# EAGLE design MCUBOARD-1-V.1.0 (EAGLE 5.06)
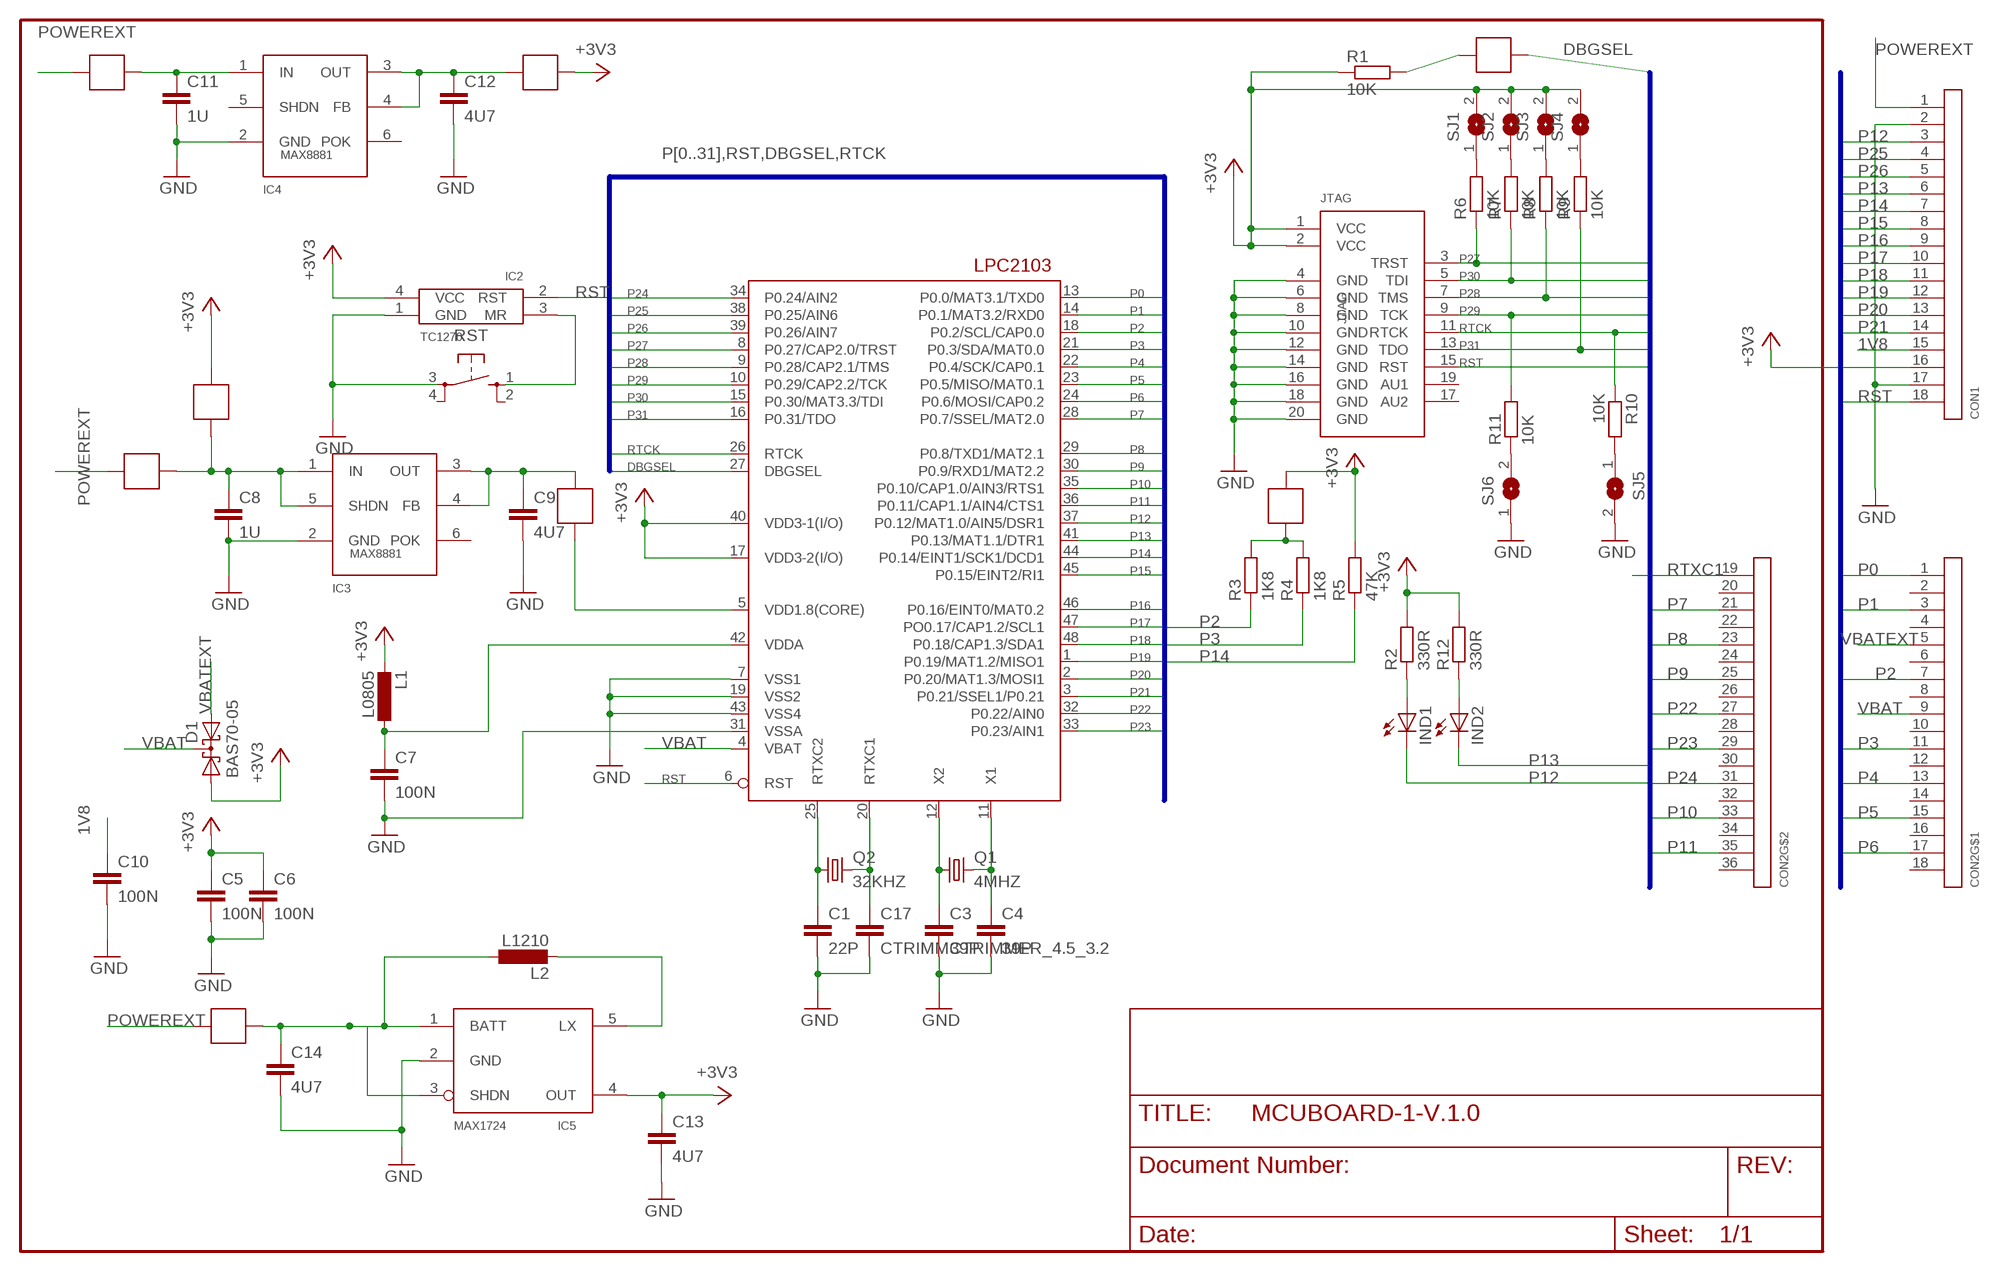
[diagram p0: schematic, sheet 1]

## Parts
C1  22P  C-EUC0805K  [C0805K]
C3  39P  C-EUC0603K  [C0603K]
C4  39P  C-EUC0603K  [C0603K]
C5  100N  C-EUC0805  [C0805]
C6  100N  C-EUC0805  [C0805]
C7  100N  C-EUC0603  [C0603]
C8  1U  C-EUC0805  [C0805]
C9  4U7  C-EUC0805  [C0805]
C10  100N  C-EUC0805  [C0805]
C11  1U  C-EUC0805  [C0805]
C12  4U7  C-EUC0805  [C0805]
C13  4U7  C-EUC0805  [C0805]
C14  4U7  C-EUC0805  [C0805]
C17  CTRIMMCTRIMMER_4.5_3.2  [CTRIMMER_4.5_3.2]
CON1  CON18ARMCON  [CON-ARMED-18-1]
CON2  CON18-2  [CON-ARMED-18-2]
D1  BAS70-05  [SOT23]
I2C  SOLDERJUMPER  [SOLDERJUMP1]
IC1  LPC2103  [LQFP48]
IC2  TC1270  [SOT143R_INFINEON]
IC3  MAX8881-18  MAX8881  [SOT23-6L]
IC4  MAX8881-33  MAX8881  [SOT23-6L]
IC5  MAX1724  [SOT23-5L]
IND1  LEDCHIPLED_0805  [CHIPLED_0805]
IND2  LEDCHIPLED_0805  [CHIPLED_0805]
JDBGSEL  SOLDERJUMPER  [SOLDERJUMP1]
JTAG  ARM-JTAGVERTIKAL  [ML20]
L1  L0805  [C0805]
L2  L1210  [C1210]
Q1  4MHZ  CRYTALHC49S  [HC49/S]
Q2  32KHZ  CRYTALTC26V  [TC26V]
R1  10K  R-EU_M0805  [M0805]
R2  330R  R-EU_M0805  [M0805]
R3  1K8  R-EU_M0805  [M0805]
R4  1K8  R-EU_M0805  [M0805]
R5  47K  R-EU_M0805  [M0805]
R6  10K  R-EU_M0805  [M0805]
R7  10K  R-EU_M0805  [M0805]
R8  10K  R-EU_M0805  [M0805]
R9  10K  R-EU_M0805  [M0805]
R10  10K  R-EU_M0805  [M0805]
R11  10K  R-EU_M0805  [M0805]
R12  330R  R-EU_M0805  [M0805]
REG3V3-1V8  SOLDERJUMPER  [SOLDERJUMP1]
RST  10XXSMD  [B3F-10XX-SMD]
SJ1  SJ  [SJ]
SJ2  SJ  [SJ]
SJ3  SJ  [SJ]
SJ4  SJ  [SJ]
SJ5  SJ  [SJ]
SJ6  SJ  [SJ]
U$1  SOLDERJUMPER  [SOLDERJUMP1]
U$2  SOLDERJUMPER  [SOLDERJUMP1]
U$3  SOLDERJUMPER  [SOLDERJUMP1]
U$4  SOLDERJUMPER  [SOLDERJUMP1]
U$6  SOLDERJUMPER  [SOLDERJUMP1]

## Nets
1V8: C10.1 CON1.15 IC1.5(VDD1.8(CORE)) U$4.2
+3V3: C5.1 C6.1 C13.1 CON1.16 D1.1(A1) I2C.1 IC1.17(VDD3-2(I/O)) IC1.40(VDD3-1(I/O)) IC2.4(VCC) IC5.4(OUT) JTAG.1(VCC) JTAG.2(VCC) L1.2 R1.1 R2.2 R5.2 R12.2 REG3V3-1V8.1 SJ1.2 SJ2.2 SJ3.2 SJ4.2 U$2.1
DBGSEL: IC1.27(DBGSEL) JDBGSEL.2
GND: C1.2 C3.2 C4.2 C5.2 C6.2 C7.2 C8.2 C9.2 C10.2 C11.2 C12.2 C13.2 C14.2 C17.P$2 CON1.2 CON1.17 IC1.7(VSS1) IC1.19(VSS2) IC1.31(VSSA) IC1.43(VSS4) IC2.1(GND) IC3.2(GND) IC4.2(GND) IC5.2(GND) JTAG.4(GND) JTAG.6(GND) JTAG.8(GND) JTAG.10(GND) JTAG.12(GND) JTAG.14(GND) JTAG.16(GND) JTAG.18(GND) JTAG.20(GND) RST.3 SJ5.2 SJ6.1
N$1: IC2.3(MR) RST.1
N$2: R6.2 SJ1.1
N$3: IND1.A R2.1
N$4: C7.1 IC1.42(VDDA) L1.1
N$5: R7.2 SJ2.1
N$6: R8.2 SJ3.1
N$7: R9.2 SJ4.1
N$8: R10.2 SJ5.1
N$9: R11.1 SJ6.2
N$10: C11.1 IC4.1(IN) U$1.1
N$11: C12.1 IC4.3(OUT) IC4.4(FB) U$2.2
N$12: C8.1 IC3.1(IN) IC3.5(SHDN) REG3V3-1V8.2 U$3.1
N$13: IC5.5(LX) L2.2
N$14: C9.1 IC3.3(OUT) IC3.4(FB) U$4.1
N$15: I2C.2 R3.2 R4.2
N$16: C14.1 IC5.1(BATT) IC5.3(SHDN) L2.1 U$6.1
N$17: IND2.A R12.1
N$18: JDBGSEL.1 R1.2
P0: CON2.1 IC1.13(P0.0/MAT3.1/TXD0)
P1: CON2.3 IC1.14(P0.1/MAT3.2/RXD0)
P2: CON2.7 IC1.18(P0.2/SCL/CAP0.0) R3.1
P3: CON2.11 IC1.21(P0.3/SDA/MAT0.0) R4.1
P4: CON2.13 IC1.22(P0.4/SCK/CAP0.1)
P5: CON2.15 IC1.23(P0.5/MISO/MAT0.1)
P6: CON2.17 IC1.24(P0.6/MOSI/CAP0.2)
P7: CON2.21 IC1.28(P0.7/SSEL/MAT2.0)
P8: CON2.23 IC1.29(P0.8/TXD1/MAT2.1)
P9: CON2.25 IC1.30(P0.9/RXD1/MAT2.2)
P10: CON2.33 IC1.35(P0.10/CAP1.0/AIN3/RTS1)
P11: CON2.35 IC1.36(P0.11/CAP1.1/AIN4/CTS1)
P12: CON1.3 IC1.37(P0.12/MAT1.0/AIN5/DSR1) IND1.C
P13: CON1.6 IC1.41(P0.13/MAT1.1/DTR1) IND2.C
P14: CON1.7 IC1.44(P0.14/EINT1/SCK1/DCD1) R5.1
P15: CON1.8 IC1.45(P0.15/EINT2/RI1)
P16: CON1.9 IC1.46(P0.16/EINT0/MAT0.2)
P17: CON1.10 IC1.47(PO0.17/CAP1.2/SCL1)
P18: CON1.11 IC1.48(P0.18/CAP1.3/SDA1)
P19: CON1.12 IC1.1(P0.19/MAT1.2/MISO1)
P20: CON1.13 IC1.2(P0.20/MAT1.3/MOSI1)
P21: CON1.14 IC1.3(P0.21/SSEL1/P0.21)
P22: CON2.27 IC1.32(P0.22/AIN0)
P23: CON2.29 IC1.33(P0.23/AIN1)
P24: CON2.31 IC1.34(P0.24/AIN2)
P25: CON1.4 IC1.38(P0.25/AIN6)
P26: CON1.5 IC1.39(P0.26/AIN7)
P27: IC1.8(P0.27/CAP2.0/TRST) JTAG.3(TRST) R6.1
P28: IC1.9(P0.28/CAP2.1/TMS) JTAG.7(TMS) R8.1
P29: IC1.10(P0.29/CAP2.2/TCK) JTAG.9(TCK) R11.2
P30: IC1.15(P0.30/MAT3.3/TDI) JTAG.5(TDI) R7.1
P31: IC1.16(P0.31/TDO) JTAG.13(TDO) R9.1
POWEREXT: CON1.1 U$1.2 U$3.2 U$6.2
RST: CON1.18 IC1.6(RST) IC2.2(RST) JTAG.15(RST)
RTCK: IC1.26(RTCK) JTAG.11(RTCK) R10.1
RTXC1: C17.P$1 CON2.19 IC1.20(RTXC1) Q2.2
RTXC2: C1.1 IC1.25(RTXC2) Q2.1
VBAT: CON2.9 D1.3(C) IC1.4(VBAT)
VBATEXT: CON2.5 D1.2(A2)
X1: C4.1 IC1.11(X1) Q1.2
X2: C3.1 IC1.12(X2) Q1.1
Unconnected: CON2.2 CON2.4 CON2.6 CON2.8 CON2.10 CON2.12 CON2.14 CON2.16 CON2.18 CON2.20 CON2.22 CON2.24 CON2.26 CON2.28 CON2.30 CON2.32 CON2.34 CON2.36 IC3.6(POK) IC4.5(SHDN) IC4.6(POK) JTAG.17(AU2) JTAG.19(AU1) RST.2 RST.4

## Buses
P[0..31],RST,DBGSEL,RTCK

## Library data of the parts
C1 C3-C14 = turbod3:C-EU: CAPACITOR, European symbol
C17 = turbod3:CTRIMM
CON1 = turbod3:CON18
CON2 = turbod3:CON18-2
D1 = diode:BAS70-05: Silicon Schottky Diodes General-purpose diode for high-speed switching
I2C JDBGSEL REG3V3-1V8 U$1-U$4 U$6 = turbod3:SOLDERJUMPER
IC1 = turbod3:LPC2103: LPC2101/2102/2103 microcontroler from Philips
IC2 = turbod3:TC1270
IC3 IC4 = turbod3:MAX8881
IC5 = turbod3:MAX1724
IND1 IND2 = turbod3:LED: LED OSRAM: - CHIPLED LG R971, LG N971, LY N971, LG Q971, LY Q971, LO R971, LY R971 LH N974, LH R974 LS Q976, LO Q976, LY Q976 LO Q996 - Hyper CHIPLED LW Q18S LB Q993, LB Q99A, LB R99A - SideLED LS A670, LO A670, LY A670, LG A670, LP A670 LB A673, LV A673, LT A673, LW A673 LH A674 LY A675 LS A676, LA A676, LO A676, LY A676, LW A676 LS A679, LY A679, LG A679 - Hyper Micro SIDELED® LS Y876, LA Y876, LO Y876, LY Y876 LT Y87S - SmartLED LW L88C, LW L88S LB L89C, LB L89S, LG L890 LS L89K, LO L89K, LY L89K LS L896, LA L896, LO L896, LY L896 - TOPLED LS T670, LO T670, LY T670, LG T670, LP T670 LSG T670, LSP T670, LSY T670, LOP T670, LYG T670 LG T671, LOG T671, LSG T671 LB T673, LV T673, LT T673, LW T673 LH T674 LS T676, LA T676, LO T676, LY T676, LB T676, LH T676, LSB T676, LW T676 LB T67C, LV T67C, LT T67C, LS T67K, LO T67K, LY T67K, LW E67C LS E67B, LA E67B, LO E67B, LY E67B, LB E67C, LV E67C, LT E67C LW T67C LS T679, LY T679, LG T679 LS T770, LO T770, LY T770, LG T770, LP T770 LB T773, LV T773, LT T773, LW T773 LH T774 LS E675, LA E675, LY E675, LS T675 LS T776, LA T776, LO T776, LY T776, LB T776 LHGB T686 LT T68C, LB T68C - Hyper Mini TOPLED® LB M676 - Mini TOPLED Santana® LG M470 LS M47K, LO M47K, LY M47K Source: http://www.osram.convergy.de LUXEON: - LUMILED® LXK2-PW12-R00, LXK2-PW12-S00, LXK2-PW14-U00, LXK2-PW14-V00 LXK2-PM12-R00, LXK2-PM12-S00, LXK2-PM14-U00 LXK2-PE12-Q00, LXK2-PE12-R00, LXK2-PE12-S00, LXK2-PE14-T00, LXK2-PE14-U00 LXK2-PB12-K00, LXK2-PB12-L00, LXK2-PB12-M00, LXK2-PB14-N00, LXK2-PB14-P00, LXK2-PB14-Q00 LXK2-PR12-L00, LXK2-PR12-M00, LXK2-PR14-Q00, LXK2-PR14-R00 LXK2-PD12-Q00, LXK2-PD12-R00, LXK2-PD12-S00 LXK2-PH12-R00, LXK2-PH12-S00 LXK2-PL12-P00, LXK2-PL12-Q00, LXK2-PL12-R00 Source: www.luxeon.com KINGBRIGHT: KA-3528ASYC Source: www.kingbright.com
JTAG = turbod3:ARM-JTAG
L1 L2 = turbod3:L
Q1 Q2 = turbod3:CRYTAL: CRYSTAL
R1-R12 = turbod3:R-EU_: RESISTOR, European symbol
RST = turbod3:10XX
SJ1-SJ6 = jumper:SJ: SMD solder JUMPER

## Board
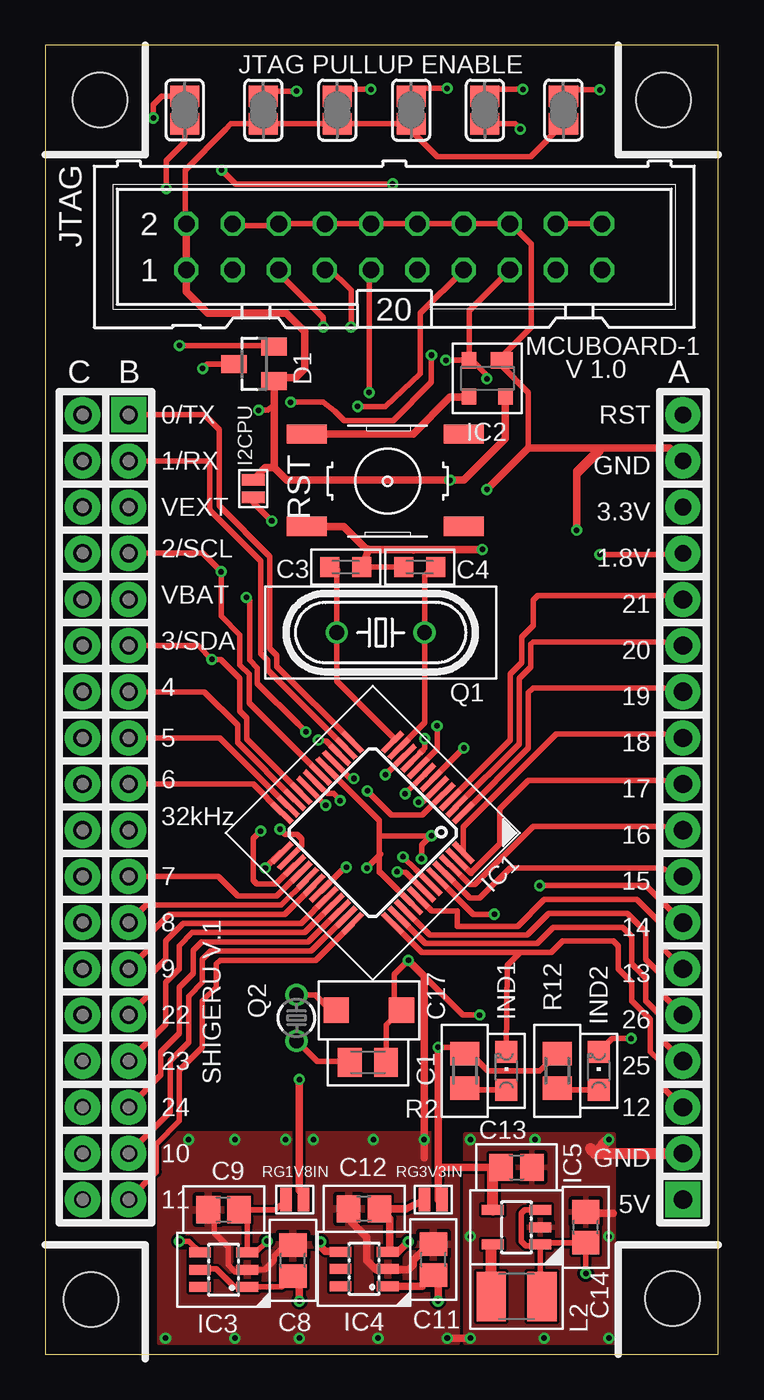
[diagram p1: board, top side]
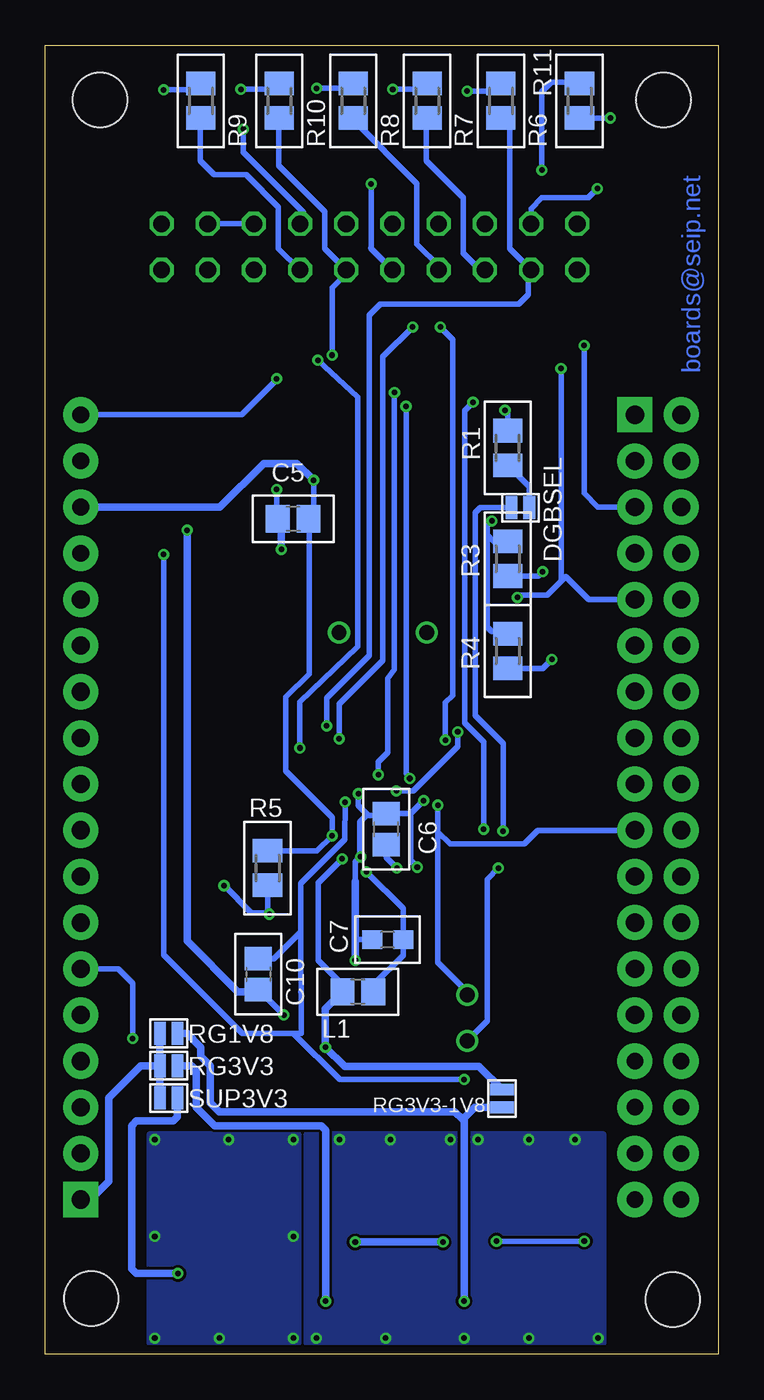
[diagram p2: board, bottom side, seen from below]

Size 37 x 72 mm. Coordinates in mm from the lower left corner, seen from the top.
Outline: 0,72 0,0 37,0 37,72 0,72
Copper layers (1*16): Top 0.035mm / dielectric 1.5mm / Bottom 0.035mm
Design rules "PCB-POOL": minimum track width 6mil, minimum drill 12mil, track to track 6mil, track to pad 6mil, pad to pad 6mil, via to via 6mil, smd to smd 6mil, copper to edge 20mil, drill to drill 8mil, minimum pad ring 8mil, minimum via ring 6mil, stop-mask expansion 3mil, vias tented up to drill 0mil, thermal gap 8mil
Holes 3 mm at 34,69 34.48,3.06 2.5,3 3,69

### Footprints (pad centres in the part's own frame; a part is rotated, then mirrored left to right if it is on the bottom)
C0805K = smd 1.3 x 1.6: 1 -1,0; 2 1,0
C0603K = smd 1.05 x 1.08: 1 -0.875,0; 2 0.875,0
C0805 = smd 1.3 x 1.5: 1 -0.85,0; 2 0.85,0
C0603 = smd 1.1 x 1: 1 -0.85,0; 2 0.85,0
CTRIMMER_4.5_3.2 = smd 1.4 x 1.4: P$1 -1.846,0; P$2 1.746,0
CON-ARMED-18-1 = drill 1 pad 1.93 square: 1 -21.59,0 | drill 1 pad 1.93 round: 2 -19.05,0; 3 -16.51,0; 4 -13.97,0; 5 -11.43,0; 6 -8.89,0; 7 -6.35,0; 8 -3.81,0; 9 -1.27,0; 10 1.27,0; 11 3.81,0; 12 6.35,0; 13 8.89,0; 14 11.43,0 | drill 0.914 pad 1.93 round: 15 13.97,0; 16 16.51,0; 17 19.05,0; 18 21.59,0
CON-ARMED-18-2 = drill 1 pad 1.93 square: 1 -21.59,1.27 | drill 1 pad 1.93 round: 2 -21.59,-1.27; 3 -19.05,1.27; 4 -19.05,-1.27; 5 -16.51,1.27; 6 -16.51,-1.27; 7 -13.97,1.27; 8 -13.97,-1.27; 9 -11.43,1.27; 10 -11.43,-1.27; 11 -8.89,1.27; 12 -8.89,-1.27; 13 -6.35,1.27; 14 -6.35,-1.27; 15 -3.81,1.27; 16 -3.81,-1.27; 17 -1.27,1.27; 18 -1.27,-1.27; 19 1.27,1.27; 20 1.27,-1.27; 21 3.81,1.27; 22 3.81,-1.27; 23 6.35,1.27; 24 6.35,-1.27; 25 8.89,1.27; 26 8.89,-1.27; 27 11.43,1.27; 28 11.43,-1.27 | drill 0.914 pad 1.93 round: 29 13.97,1.27; 30 13.97,-1.27; 31 16.51,1.27; 32 16.51,-1.27; 33 19.05,1.27; 34 19.05,-1.27; 35 21.59,1.27; 36 21.59,-1.27
SOT23 = smd 1 x 1.4: 1 -0.95,-1.1; 2 0.95,-1.1; 3 0,1.1
SOLDERJUMP1 = smd 1.27 x 0.635: 1 0,0.483; 2 0,-0.483
LQFP48 = smd 1.5 x 0.3: 1 -4.3,2.75; 2 -4.3,2.25; 3 -4.3,1.75; 4 -4.3,1.25; 5 -4.3,0.75; 6 -4.3,0.25; 7 -4.3,-0.25; 8 -4.3,-0.75; 9 -4.3,-1.25; 10 -4.3,-1.75; 11 -4.3,-2.25; 12 -4.3,-2.75; 25 4.3,-2.75; 26 4.3,-2.25; 27 4.3,-1.75; 28 4.3,-1.25; 29 4.3,-0.75; 30 4.3,-0.25; 31 4.3,0.25; 32 4.3,0.75; 33 4.3,1.25; 34 4.3,1.75; 35 4.3,2.25; 36 4.3,2.75 | smd 0.3 x 1.5: 13 -2.75,-4.3; 14 -2.25,-4.3; 15 -1.75,-4.3; 16 -1.25,-4.3; 17 -0.75,-4.3; 18 -0.25,-4.3; 19 0.25,-4.3; 20 0.75,-4.3; 21 1.25,-4.3; 22 1.75,-4.3; 23 2.25,-4.3; 24 2.75,-4.3; 37 2.75,4.3; 38 2.25,4.3; 39 1.75,4.3; 40 1.25,4.3; 41 0.75,4.3; 42 0.25,4.3; 43 -0.25,4.3; 44 -0.75,4.3; 45 -1.25,4.3; 46 -1.75,4.3; 47 -2.25,4.3; 48 -2.75,4.3
SOT143R_INFINEON = smd 1.2 x 0.9: 1 -0.8,-1 | smd 0.8 x 0.9: 2 1,-1; 3 1,1; 4 -1,1
SOT23-6L = smd 0.55 x 1.2: 1 -0.95,-1.3; 2 0,-1.3; 3 0.95,-1.3; 4 0.95,1.3; 5 0,1.3; 6 -0.95,1.3
SOT23-5L = smd 0.55 x 1.2: 1 -0.95,-1.3; 2 0,-1.3; 3 0.95,-1.3; 4 0.95,1.3; 5 -0.95,1.3
CHIPLED_0805 = smd 1.2 x 1.2: A 0,-1.05; C 0,1.05
ML20 = drill 0.914 octagon: 1 -11.43,-1.27; 2 -11.43,1.27; 3 -8.89,-1.27; 4 -8.89,1.27; 5 -6.35,-1.27; 6 -6.35,1.27; 7 -3.81,-1.27; 8 -3.81,1.27; 9 -1.27,-1.27; 10 -1.27,1.27; 11 1.27,-1.27; 12 1.27,1.27; 13 3.81,-1.27; 14 3.81,1.27; 15 6.35,-1.27; 16 6.35,1.27; 17 8.89,-1.27; 18 8.89,1.27; 19 11.43,-1.27; 20 11.43,1.27
C1210 = smd 1.6 x 2.7: 1 -1.4,0; 2 1.4,0
HC49/S = drill 0.813 round: 1 -2.413,0; 2 2.413,0
TC26V = drill 0.813 round: 1 -1.27,0; 2 1.27,0
M0805 = smd 1.3 x 1.6: 1 -0.95,0; 2 0.95,0
B3F-10XX-SMD = smd 2.184 x 1.067: 1 -4.572,2.54; 2 4.064,2.54; 3 -4.572,-2.54; 4 4.064,-2.54
SJ = smd 1.168 x 1.6: 1 -0.762,0; 2 0.762,0

### Placement (x,y rotation side)
C1  17.74,16.04 0 top
C3  16.52,43.3 0 top
C4  20.58,43.3 180 top
C5  23.38,45.95 180 bottom
C6  18.26,28.88 90 bottom
C7  18.18,22.8 180 bottom
C8  13.61,5.15 90 top
C9  9.8,7.95 180 top
C10  25.29,20.9 270 bottom
C11  21.34,5.2 90 top
C12  17.53,7.99 180 top
C13  25.91,10.28 0 top
C14  29.72,6.98 90 top
C17  17.84,18.91 0 top
CON1  35.06,30.09 90 top
CON2  3.31,30.09 270 top
D1  11.47,54.47 90 top
I2C  11.43,47.62 0 top
IC1  17.99,28.68 225 top
IC2  24.3,53.68 180 top
IC3  9.8,4.64 90 top
IC4  17.53,4.69 90 top
IC5  25.91,6.98 90 top
IND1  25.35,15.58 0 top
IND2  30.43,15.58 0 top
JDBGSEL  10.87,46.57 270 bottom
JTAG  19.18,60.92 0 top
L1  19.82,19.93 180 bottom
L2  25.91,3.17 180 top
Q1  18.44,39.7 0 top
Q2  13.81,18.49 90 top
R1  11.58,49.86 270 bottom
R2  23.07,15.58 90 top
R3  11.58,43.76 90 bottom
R4  11.58,38.68 90 bottom
R5  24.79,26.74 90 bottom
R6  11.95,68.95 90 bottom
R7  16.01,68.95 90 bottom
R8  20.08,68.95 90 bottom
R9  28.46,68.95 90 bottom
R10  24.14,68.95 90 bottom
R11  7.63,68.95 90 bottom
R12  28.15,15.58 90 top
REG3V3-1V8  11.89,14.06 0 bottom
RST  18.95,48.08 0 top
SJ1  11.98,68.44 270 top
SJ2  16.04,68.44 270 top
SJ3  20.11,68.44 270 top
SJ4  28.49,68.44 270 top
SJ5  24.17,68.44 270 top
SJ6  7.66,68.44 90 top
U$1  30.23,15.87 270 bottom
U$2  21.34,8.5 270 top
U$3  30.23,17.64 270 bottom
U$4  13.72,8.5 90 top
U$6  30.23,14.09 270 bottom

### Tracks (layer width: path | path; a pad name or v marks a point on that pad's centre or on a via)
1V8  (via drill 0.3)
  Top 0.305: v30.5,44 33.73,44 CON1.15 | v20.52,30.37 20.75,30.37 IC1.5
  Top 0.406: U$4.2 14.2,8.78 13.97,9.01 v13.97,15.1
  Bottom 0.305: v20.52,30.37 20.55,28.32 22.96,25.9 22.95,23.23 | 22.93,17.65 22.93,18.15 | 22.93,18.15 22.95,23.23 | v30.5,44 30.5,21.97 26.17,17.64 26.16,17.65 23.37,17.65 | 23.37,17.65 22.93,17.65 | 22.93,17.65 22.94,17.66 22.94,19.9 22.97,19.93 | C10.1 24.43,21.75 22.95,23.23 | 22.93,17.65 22.93,18.15 | v13.97,15.1 20.82,15.1 23.37,17.65
+3V3  (via drill 0.3)
  Top 0.305: IC1.17 15.48,32.24 18.36,29.36 18.36,28.52 | 18.36,28.52 18.36,27.5 | 18.36,27.5 18.36,26.49 18.42,26.49 IC1.40 | 18.36,28.52 v21.23,28.52 v21.23,28.53 21.22,28.54 20.68,28.01 v20.68,27.24 | IC1.40 20.17,24.76 | 25.3,52.14 25.3,52.4 IC2.4 | 18.36,27.5 18.44,27.5 v17.68,26.74 | JTAG.2 7.75,62.27 | 7.75,62.14 | 7.75,62.14 JTAG.2 | 7.75,62.14 | JTAG.2 7.75,62.17 7.68,62.09 7.68,65.14 9.92,67.38 9.92,67.4 10.2,67.68 SJ1.2 | 12.55,53.52 12.49,53.46 | D1.1 12.55,53.52 | 12.55,53.52 12.74,53.71 | 12.57,52.19 12.49,52.19 12.23,51.93 v11.73,51.93 | SJ1.2 11.73,67.68 | SJ1.2 SJ2.2 SJ3.2 20.11,67.31 21.54,65.87 26.68,65.87 SJ4.2 | IC1.40 | 24.61,10.08 C13.1 | v21.6,16.88 23.46,16.88 | 23.46,16.88 R2.2 | 27.83,16.53 R12.2 27.2,15.58 24.34,15.58 23.46,16.46 23.46,16.88
  Top 0.406: 25.3,52.4 25.3,50.36 23.01,48.08 v22.25,48.08 13.26,48.08 12.57,48.77 | JTAG.2 7.7,62.19 | JTAG.2 | JTAG.2 7.8,62.19 | 7.75,62.14 JTAG.1 7.75,58.45 8.93,57.27 13.25,57.27 14.27,56.25 14.27,54.22 13.76,53.71 12.74,53.71 | D1.1 12.57,52.19 12.57,48.77 | 21.6,10.28 v21.6,16.88 | 21.6,10.28 21.6,8.5 U$2.1 | IC5.4 24.61,10.28 21.6,10.28 | 12.57,48.77 12.1,48.77 I2C.1
  Top 0.61: IC5.4 24.61,10.08
  Bottom 0.305: L1.2 20.34,20.01 21.99,21.66 21.99,25.93 v20.68,27.24 | 22.5,45.79 22.53,45.81 C5.1 | v22.25,48.08 22.25,46.05 22.5,45.79 | 22.5,45.79 22.5,37.41 23.77,36.14 23.77,32.08 21.23,29.54 v21.23,28.52 22.07,27.68 24.8,27.68 | 24.8,27.68 24.81,27.68 | 24.8,27.68 R5.2 | C6.1 18.26,27.33 v17.68,26.74 | R1.1 11.58,51.79 v11.73,51.93
  Bottom 0.406: L1.2 21.6,19 v21.6,16.88 20.55,15.83 13.16,15.83 11.89,14.56 REG3V3-1V8.1 | CON1.16 27.4,46.6 25,49 23.17,49 v22.25,48.08
DBGSEL  (via drill 0.3)
  Top 0.305: IC1.27 13.72,26.9 12.67,25.85 11.63,25.85 11.43,26.06 11.43,28.37 v11.83,28.77
  Bottom 0.305: v11.83,28.77 11.83,33.6 13.36,35.12 13.36,46.3 13.09,46.57 JDBGSEL.2
GND  (via drill 0.3)
  Top 0.305: C9.2 9.15,7.82 9.28,7.95 9.28,6.68 10.04,5.91 10.04,4.9 10.42,4.52 IC3.2 11.21,4.55 11.31,4.64 12.07,4.64 12.58,5.15 12.58,5.41 13.18,6 C8.2 13.65,5.96 | C3.2 C4.2 | 26.57,49.86 26.57,52.9 25.1,54.37 IC2.1 25.1,54.89 26.71,56.51 26.71,61.08 25.6,62.19 JTAG.16 25.38,62.19 | 20.88,31.9 IC1.7 v19.78,30.83 | IC1.19 14.78,31.52 15.49,30.83 15.85,30.83 v16.2,30.45 | IC1.43 20.37,26.66 v19.66,27.36 | 20.96,5.9 21.47,5.9 | JTAG.4 10.39,62.09 12.93,62.09 JTAG.6 JTAG.8 JTAG.10 JTAG.12 | JTAG.12 20.5,62.19 | JTAG.12 | JTAG.12 JTAG.14 25.38,62.19 | JTAG.20 30.71,62.19 | JTAG.20 | JTAG.18 JTAG.20 | 25.38,62.19 25.78,62.19 | IC1.31 15.15,25.46 16.48,26.79 v16.55,26.79 | v6.65,64.13 6.65,65.65 7.66,66.67 SJ6.1 | v23.88,18.66 22.96,18.66 20.84,20.79 | 19.18,18.53 C17.P$2 | 19.18,18.53 18.74,18.12 C1.2 | v19.96,21.66 19.18,20.88 19.18,18.53 | 26.5,10.19 C13.2 | SJ5.2 25.83,67.68 v26.11,67.4
  Top 0.406: RST.3 16.41,45.54 17.68,44.27 17.75,44.27 | 17.68,43.25 C3.2 17.79,44.26 17.75,44.29 17.75,44.27 | C4.2 19.34,43.39 | v24.03,44.27 20.24,44.27 | 20.24,44.27 20.22,44.27 | v24.28,47.57 26.57,49.86 30.48,49.86 | 21.47,5.9 C11.2 | 18.95,4.64 18.69,4.64 | IC4.2 18.95,4.64 | 18.95,4.64 18.18,4.64 17.68,5.15 17.68,6.42 16.84,7.26 C12.2 16.83,8.55 | 20.96,5.9 20.22,5.15 20.22,4.9 19.96,4.64 18.95,4.64 | 20.24,44.27 20.24,44.24 20.22,44.27 | 20.22,44.27 17.75,44.27 | 20.84,10.79 20.84,20.79 v19.96,21.66 | 30.48,49.86 34.34,49.86 CON1.17 | 34.54,11.04 CON1.2 | 31.24,7.74 29.81,7.74 C14.2 | v22.1,0.88 v23.37,0.88 | v29.21,45.33 29.21,48.38 | 29.21,48.38 30.48,49.65 | 29.21,48.38 29.21,48.59 30.48,49.86
  Top 0.61: 30.23,11.04 34.54,11.04 | 29.97,11.29 30.23,11.04 | 30.23,11.04 v30.99,11.8
  Bottom 0.305: JTAG.16 JTAG.18 | C5.2 24.23,45.85 24.28,45.79 v24.28,47.57 | v19.78,30.83 19.78,30.17 19.25,29.64 | 19.25,29.64 18.21,29.64 18.16,29.69 18.2,29.73 C6.2 18.25,29.74 16.91,29.74 | 16.91,29.74 v16.2,30.45 | 19.25,29.64 19.35,29.64 19.71,29.28 19.71,27.41 v19.67,27.37 | 16.91,29.74 16.91,27.15 v16.55,26.79 | 19.96,22.67 20.01,22.67 19.88,22.8 C7.2 | JTAG.4 10.29,63.02 9.69,63.62 7.15,63.62 v6.65,64.13 | v19.67,27.37 v19.66,27.37 v19.66,27.36 | 19.96,25.99 19.96,27.08 v19.67,27.37 | C10.2 25.27,20.05 v23.88,18.66 | v26.11,67.4 26.11,66.13 22.81,62.82 22.81,62.37 JTAG.14
  Bottom 0.406: 24.23,45.99 24.28,46.05 | C5.2 24.23,45.99 | v24.03,44.27 24.03,45.79 24.23,45.99 | v19.96,21.66 19.96,22.67 19.96,25.99 | v29.21,45.33 29.21,22.72 26.42,19.93 25.41,19.93 C10.2
  other vias: 18.29,0.88 13.97,0.88 10.41,0.88 6.6,0.88 7.87,11.8 10.41,11.8 13.21,11.8 14.73,11.8 18.03,11.8 20.83,11.8 30.99,0.88 23.37,11.8 27.43,0.88 26.92,11.8 23.37,6.47 30.99,6.47
  pour Top: 31.24,12.06 31.24,0.63 23.11,0.63 23.11,12.06
  pour Top: 22.61,12.06 22.61,0.63 6.35,0.63 6.35,12.06
  pour Bottom: 31.24,12.06 31.24,0.63 23.11,0.63 23.11,12.06
  pour Bottom: 22.61,12.06 22.61,0.63 6.35,0.63 6.35,12.06
N$1
  Top 0.406: RST.1 20.22,50.62 22.25,52.65 23.26,52.65 IC2.3
N$2  (via drill 0.3)
  Top 0.305: SJ1.1 11.98,69.48 v13.81,69.48
  Bottom 0.305: R6.2 11.95,69.72 12.18,69.48 v13.81,69.48
N$3
  Top 0.305: IND1.A 23.17,14.53 R2.1
  Top 0.406: IND1.A 25.37,14.52
N$4  (via drill 0.3)
  Top 0.305: IC1.42 20.9,25.44 19.83,26.51 v19.35,26.53
  Bottom 0.305: v19.35,26.53 17.33,24.52 C7.1 17.33,21.94 18.86,20.42 L1.1
N$5  (via drill 0.3)
  Top 0.305: v17.9,69.59 16.43,69.59 SJ2.1
  Bottom 0.305: R7.2 16.31,69.9 16.63,69.59 v17.9,69.59
N$6  (via drill 0.3)
  Top 0.305: SJ3.1 20.11,69.26 20.49,69.64 v22.09,69.64
  Bottom 0.305: R8.2 20.25,69.9 20.51,69.64 v22.09,69.64
N$7  (via drill 0.3)
  Top 0.305: SJ4.1 28.54,69.21 28.9,69.56 v30.5,69.56
  Bottom 0.305: R9.2 28.56,69.9 28.9,69.56 v30.5,69.56
N$8  (via drill 0.3)
  Top 0.305: SJ5.1 24.12,69.21 24.5,69.59 v26.25,69.59
  Bottom 0.305: R10.2 24.14,69.87 24.43,69.59 v26.25,69.59
N$9  (via drill 0.3)
  Top 0.305: v5.94,68.01 5.94,68.75 6.39,69.21 7.59,69.21 7.61,69.18 7.64,69.21 SJ6.2
  Bottom 0.305: R11.1 5.95,68 v5.94,68.01
N$10  (via drill 0.3)
  Top 0.305: 20.73,3.74 C11.1
  Top 0.406: IC4.1 20.73,3.74 | v21.59,2.91 21.59,4.09 C11.1
  Bottom 0.406: U$1.1 28.96,15.87 28.7,15.61 28.7,13.58 27.69,12.56 21.84,12.56 21.59,12.31 v21.59,2.91
N$11  (via drill 0.3)
  Top 0.406: v19.96,6.17 19.39,5.59 IC4.3 18.96,5.65 18.95,5.66 18.95,7.44 18.54,7.84 C12.1 19.84,7.99 U$2.2 | v15.14,6.17 15.14,5.91 15.39,5.66 16.15,5.66 16.22,5.59 IC4.4
  Bottom 0.406: v15.14,6.17 v19.96,6.17
N$12  (via drill 0.3)
  Top 0.305: IC3.5 8.55,4.69 9.4,4.69 10.39,3.69 IC3.1 13,3.69 C8.1 14,4.69
  Top 0.406: v13.97,2.91 13.97,3.94 C8.1
  Bottom 0.406: U$3.1 29.21,17.64 28.45,16.88 28.45,16.37 27.94,15.87 27.94,13.83 27.43,13.33 14.48,13.33 14.06,12.91 | 14.06,12.91 13.97,12.82 v13.97,2.91 | REG3V3-1V8.2 13.39,13.57 14.06,12.91
N$13
  Top 0.305: 24.51,5.93 IC5.5
  Top 0.61: L2.2 24.51,5.93
N$14  (via drill 0.3)
  Top 0.305: v12.19,6.21 11.57,5.59 IC3.3 11.1,7.5 C9.1 12.68,7.95 U$4.1 | v7.37,6.21 7.88,6.21 IC3.4
  Bottom 0.305: v7.37,6.21 v12.19,6.21
N$15  (via drill 0.3)
  Top 0.305: I2C.2 11.43,46.85 v12.45,45.84
  Bottom 0.305: v12.45,45.84 12.7,45.58 12.7,45.08 | 12.7,45.08 12.7,40 12.45,39.74 11.69,39.74 R4.2 | R3.2 12.33,44.71 12.7,45.08
N$16  (via drill 0.3)
  Top 0.305: IC5.1 27.31,6.13 C14.1 v29.72,4.44 | IC5.3 26.35,7.93 26.16,7.74 26.16,6.21 26.42,5.96 27.14,5.96 IC5.1 | IC5.1 27.21,3.96 27.18,3.93 27.18,3.3 L2.1
  Bottom 0.406: 29.74,4.46 v29.72,4.44 32,4.44 32.26,4.69 32.26,12.56 32,12.82 29.97,12.82 29.74,13.05 U$6.1
N$17
  Top 0.305: IND2.A 28.25,14.53 R12.1
N$18
  Bottom 0.305: JDBGSEL.1 10.39,47.72 R1.2
P0
  Top 0.305: IC1.13 12.72,37.84 12.72,38.43 12.34,38.81 12.34,43.89 9.55,46.68 9.55,50.87 8.74,51.68 CON2.1
P1
  Top 0.305: IC1.14 12.21,37.64 12.21,38.17 11.83,38.55 11.83,43.63 9.04,46.43 9.04,49.09 8.99,49.14 CON2.3
P2  (via drill 0.3)
  Top 0.305: IC1.18 11.2,35.83 11.2,37.41 10.69,37.92 10.69,39.57 9.66,40.6 v9.66,43.04 8.64,44.06 CON2.7
  Bottom 0.305: R3.1 9.89,42.81 v9.66,43.04
P3  (via drill 0.3)
  Top 0.305: IC1.21 11.07,33.83 11.07,35 10.69,35.38 10.69,37.16 9.63,38.22 v9.15,38.22 8.39,38.98 CON2.11
  Bottom 0.305: R4.1 9.64,37.73 v9.15,38.22
P4
  Top 0.305: IC1.22 10.56,33.63 10.56,34.62 8.74,36.44 CON2.13
P5
  Top 0.305: IC1.23 9.59,33.9 CON2.15
P6
  Top 0.305: IC1.24 11.43,31.36 CON2.17
P7
  Top 0.305: IC1.28 14.03,26.52 12.72,25.22 10.56,25.22 9.5,26.28 CON2.21
P8
  Top 0.305: IC1.29 14.31,26.04 12.98,24.71 5.55,24.71 CON2.23
P9
  Top 0.305: IC1.30 13.16,24.2 6.81,24.2 5.84,23.23 5.84,22.46 CON2.25
P10
  Top 0.305: IC1.35 16.51,24.05 14.63,22.17 9.1,22.17 8.64,21.71 8.64,20.44 7.87,19.68 7.87,17.14 6.86,16.12 6.86,13.32 CON2.33
P11
  Top 0.305: IC1.36 14.86,21.66 9.61,21.66 9.4,21.45 9.4,20.18 8.64,19.42 8.64,16.88 7.37,15.61 7.37,12.82 6.1,11.55 6.1,10.02 CON2.35
P12
  Top 0.305: IC1.37 20.69,22.09 26.11,22.09 | 33.78,14.85 CON1.3 33.78,14.86 33.78,16.12 33.27,16.63 33.27,18.41 32.26,19.42 32.26,20.44 31.5,21.2 31.5,22.47 31.24,22.72 28.45,22.72 27.82,22.09 26.11,22.09 | IND1.C 25.41,21.39 26.11,22.09
P13  (via drill 0.3)
  Top 0.305: IC1.41 21.23,24.38 22.65,24.38 22.65,23.54 25.96,23.54 27.43,25.01 32.51,25.01 33.78,23.74 33.78,22.48 CON1.6 | v32.21,17.36 31.16,17.36 IND2.C
  Bottom 0.305: CON1.6 33,21.2 32.21,20.41 v32.21,17.36
P14  (via drill 0.3)
  Top 0.305: IC1.44 23.53,24.2 v24.69,24.2 | v27.18,25.77 33.03,25.77 CON1.7
  Bottom 0.305: R5.1 24.77,25.78 24.76,25.78 24.76,24.28 | v24.69,24.2 24.76,24.28 | 24.76,24.28 25.68,24.28 v27.18,25.77
P15
  Top 0.305: IC1.45 21.92,26.51 23.34,25.09 23.9,25.09 25.55,26.74 33.84,26.74 CON1.8
P16
  Top 0.305: IC1.46 22.29,26.88 23.34,25.83 23.62,25.83 26.82,29.03 34,29.03 CON1.9
P17
  Top 0.305: IC1.47 23.42,26.44 23.42,26.49 24.99,28.06 24.99,29.99 26.57,31.57 34,31.57 CON1.10
P18
  Top 0.305: IC1.48 22.98,28.99 28.09,34.11 34,34.11 CON1.11
P19
  Top 0.305: IC1.1 23,29.78 26.57,33.35 26.57,36.39 26.82,36.65 34,36.65 CON1.12
P20
  Top 0.305: IC1.2 22.52,30.04 26.06,33.57 26.06,37.16 26.69,37.79 26.69,39.06 26.82,39.19 34,39.19 CON1.13
P21
  Top 0.305: IC1.3 22.31,30.54 25.55,33.78 25.55,37.41 26.18,38.05 26.18,39.44 26.82,40.08 26.82,41.47 27.07,41.73 34,41.73 CON1.14
P22
  Top 0.305: IC1.32 14.07,23.69 7.57,23.69 6.6,22.72 6.6,21.71 5.84,20.95 5.84,19.92 CON2.27
P23
  Top 0.305: IC1.33 14.26,23.19 8.08,23.19 7.37,22.47 7.37,21.2 6.6,20.44 6.6,18.14 CON2.29
P24
  Top 0.305: IC1.34 14.46,22.68 8.59,22.68 8.13,22.22 8.13,20.95 7.37,20.18 7.37,17.64 6.35,16.63 6.35,15.35 CON2.31
P25
  Top 0.305: IC1.38 20.89,22.6 27.06,22.6 27.94,23.49 31.75,23.49 32.26,22.98 32.26,21.45 33.02,20.69 33.02,19.42 33.78,18.66 33.78,17.4 CON1.4
P26
  Top 0.305: IC1.39 21.14,23.06 26.5,23.06 27.69,24.25 32,24.25 33.02,23.23 33.02,21.71 33.78,20.95 33.78,19.94 CON1.5
P27  (via drill 0.3)
  Top 0.305: IC1.8 | IC1.8 20.42,32.18 | v21.54,34.56 21.54,33.3 IC1.8
  Bottom 0.305: v21.54,34.56 21.54,36.09 19.2,38.43 19.2,57.16 18.58,57.78 10.96,57.78 10.46,58.28 10.46,59.3 10.2,59.55 JTAG.3 | JTAG.3 | 11.95,67.94 R6.1 11.95,67.97 11.98,67.94 11.47,67.43 11.47,60.82 JTAG.3
P28  (via drill 0.3)
  Top 0.305: IC1.9 20.15,32.62 20.61,33.08 | 20.61,33.08 20.78,33.24 | 20.61,33.08 20.6,33.09 20.85,33.35 v20.85,33.85 | JTAG.7 15.54,59.81 16.81,58.54 v16.81,56.51
  Bottom 0.305: v20.85,33.85 20.85,35.76 18.44,38.17 18.44,54.87 v16.81,56.51 | JTAG.7 15.37,59.73 15.3,59.81 16.57,61.08 16.57,64.4 20.11,67.94 20.08,67.97 R8.1
P29  (via drill 0.3)
  Top 0.305: IC1.10 19.78,32.96 v18.69,31.87 | v19.09,64.38 10.46,64.38 v9.69,65.14 | JTAG.9 18.08,59.81 | JTAG.9 | v17.8,52.9 17.8,59.53 JTAG.9
  Bottom 0.305: v17.8,52.9 17.8,37.66 18.18,37.16 18.18,33.09 18.69,32.58 v18.69,31.87 | 7.63,69.97 R11.2 7.63,69.94 7.66,69.97 9.19,69.97 9.69,69.46 v9.69,65.14 | JTAG.9 19.11,60.85 19.09,60.87 v19.09,64.38
P30  (via drill 0.3)
  Top 0.305: IC1.15 16.19,32.98 15.44,33.73 v15.01,33.78 | JTAG.5 12.74,59.55 15.28,57.01 v15.28,56.51
  Bottom 0.305: v15.01,33.78 15.01,35.84 14.6,36.24 14.6,55.83 v15.28,56.51 | 12.93,59.6 12.88,59.65 JTAG.5 | JTAG.5 12.92,59.65 13.01,59.55 14.03,60.57 14.03,63.63 16.04,65.65 16.04,67.94 16.01,67.97 R7.1 | JTAG.5 12.9,59.65
P31  (via drill 0.3)
  Top 0.305: IC1.16 15.85,32.61 16.43,32 16.76,31.67 v16.96,31.67 | v17.17,52.14 18.69,52.14 20.62,53.95 20.62,57.27 JTAG.13
  Bottom 0.305: v16.96,31.67 16.94,31.67 16.91,31.7 17.17,31.95 v17.17,52.14 | 22.99,59.63 22.92,59.55 | JTAG.13 22.99,59.63 | 22.99,59.63 24.19,60.82 24.19,63.11 25.97,64.89 27.73,64.89 28.49,65.65 28.49,68.03 | 28.49,68.03 28.49,68.19 | 28.49,68.03 R9.1
POWEREXT
  Bottom 0.406: U$1.2 U$6.2 | U$1.2 U$3.2 | CON1.1 34.54,8.5 33.53,9.52 33.53,14.09 31.75,15.87 U$1.2
RST  (via drill 0.3)
  Top 0.305: IC1.6 v23.01,33.35 | v22.02,54.68 IC2.2 | IC2.2 23.3,54.65 | 25.53,59.7 JTAG.15 23.3,57.41 IC2.2 | IC2.2 23.36,54.68 23.41,54.73 24.28,53.86 v24.28,53.67
  Bottom 0.305: v23.01,33.35 23.01,35.89 19.84,38.93 19.84,52.65 v22.02,54.68 | v24.28,53.67 24.28,53.6 26.2,51.68 CON1.18
RTCK  (via drill 0.3)
  Top 0.305: IC1.26 14.1,27.96 14.1,28.34 13.84,28.6 13.18,28.6 v12.9,28.88 | v13.49,52.37 15.29,52.37 15.9,51.89 16.43,51.35 19.12,51.35 21.23,53.46 v21.23,54.96
  Bottom 0.305: v12.9,28.88 12.9,33.68 13.94,34.72 13.94,51.91 v13.49,52.37 | 20.4,59.7 JTAG.11 | 20.45,59.63 20.38,59.55 | JTAG.11 20.45,59.63 | 20.45,59.63 21.65,60.82 21.65,62.86 24.17,65.38 24.17,67.97 R10.1 | JTAG.11 20.36,59.55 21.23,58.68 v21.23,54.96
RTXC1  (via drill 0.3)
  Top 0.305: IC1.20 v15.42,30.2 | Q2.2 14.84,19.76 15.69,18.91 C17.P$1
  Bottom 0.305: 15.42,29.33 v15.42,30.2 | 15.42,29.33 15.42,21.54 13.81,19.93 Q2.2 | 15.42,29.33 15.42,28.73 14.74,28.06 10.68,28.06 9.91,28.82 CON2.19
RTXC2  (via drill 0.3)
  Top 0.305: IC1.25 12.93,27.59 v12.09,26.74 | 16.52,16.02 16.66,16.02 C1.1 16.69,16.09 14.94,16.09 Q2.1
  Bottom 0.305: v12.09,26.74 12.71,26.12 12.71,18.32 Q2.1
VBAT  (via drill 0.3)
  Top 0.305: IC1.4 21.9,30.84 20.72,29.66 19.02,29.66 v17.7,30.98 | v14.32,34.23 13.92,34.67 11.66,36.9 11.66,37.74 11.22,38.2 11.22,41.45 v11.05,41.63 | D1.3 8.9,54.47 v8.64,54.22
  Bottom 0.305: v17.7,30.98 16.76,30.98 14.32,33.42 v14.32,34.23 | 8.64,42.54 v8.64,54.22 | 8.64,42.54 9.41,41.77 10.9,41.77 v11.05,41.63 | 8.64,42.54 8.39,42.79 7.12,41.52 CON2.9
VBATEXT  (via drill 0.3)
  Top 0.305: D1.2 12.05,55.42 11.98,55.49 v7.37,55.49
  Bottom 0.305: v7.37,55.49 7.37,47.36 6.61,46.6 CON2.5
X1
  Top 0.305: 19.2,33.09 19.42,33.31 | 19.42,33.31 IC1.11 | 19.42,33.31 20.85,34.74 Q1.2 20.85,42.87 21.23,43.25 C4.1
X2
  Top 0.305: IC1.12 19.09,33.74 19.2,33.85 16.03,37.03 Q1.1 16.03,43.12
  Top 0.406: 16.03,43.12 15.82,43.12 C3.1

### Text on the board
Bottom: boards@seip.net
tNames: JTAG PULLUP ENABLE | MCUBOARD-1 | V 1.0 | C | B | A | RST | 0/TX | 1/RX | I2CPU | GND | 3.3V | VEXT | 2/SCL | 1.8V | 21 | VBAT | 3/SDA | 20 | 19 | 4 | 18 | 5 | 17 | 6 | 32kHz | 16 | 7 | 15 | 14 | 8 | 9 | 13 | 26 | 22 | 23 | 25 | SHIGERU V.1 | 12 | 24 | GND | 10 | RG1V8IN | RG3V3IN | 5V | 11
bNames: DGBSEL | RG1V8 | RG3V3 | RG3V3-1V8 | SUP3V3